# EAGLE design ONOFRE_ESTORES_COVERS_R1.1 (EAGLE 9.4.1)
CNAME: BH ONOFRE; CREVISION: 5.1; DESIGNER: BrunoHorta
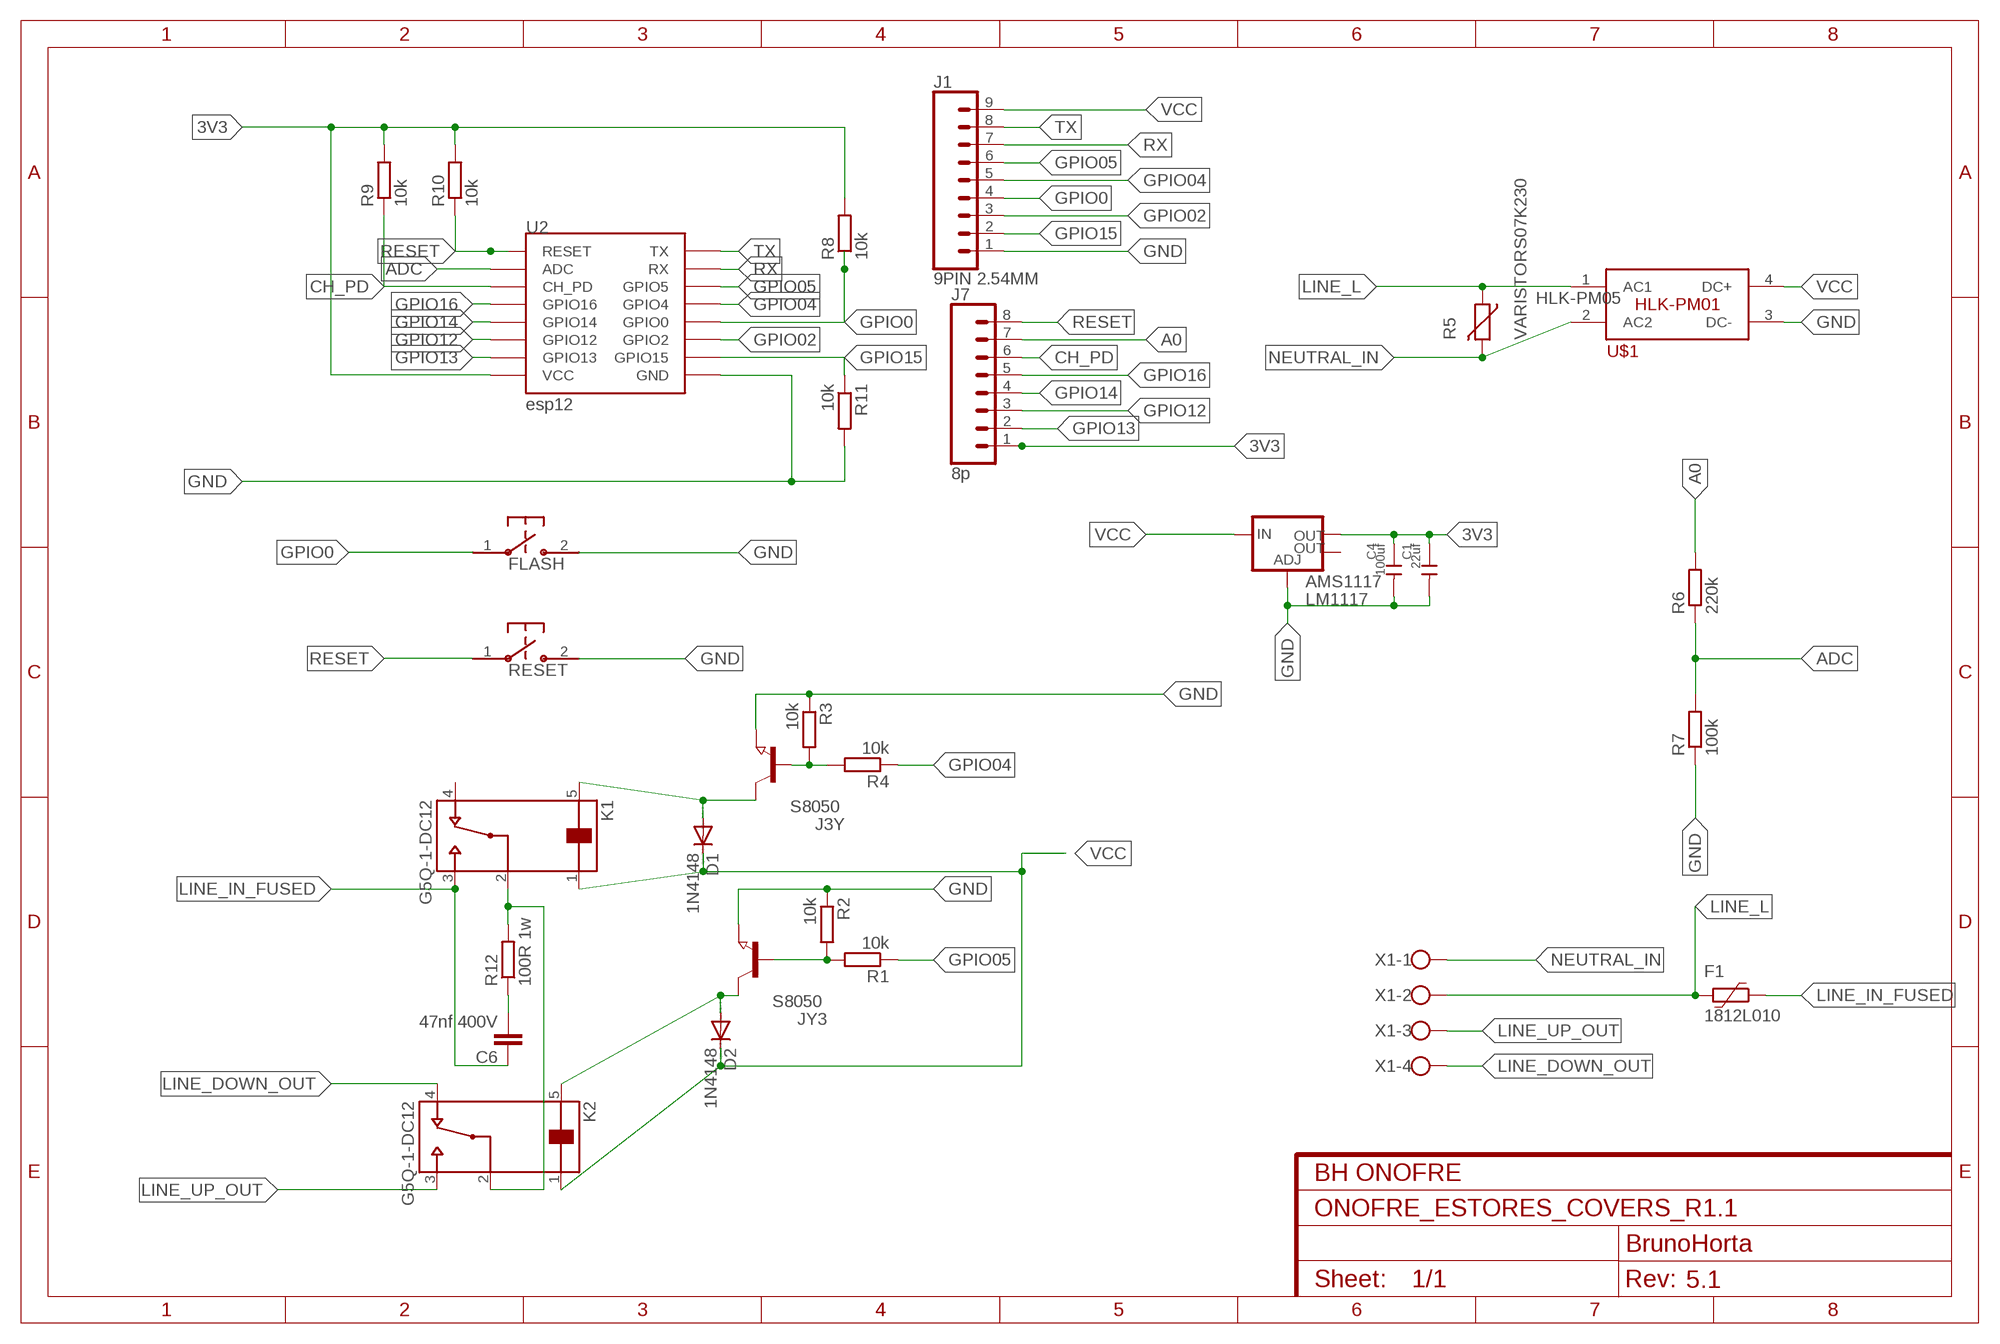
[diagram p0: schematic, sheet 1]

## Parts
AMS1117  LM1117  V_REG_LM1117SOT223  [SOT223]
C1  22uf  CERAMIC-1NF-1KV-10%-X7R(1206)  [C1206]
C4  100uf  CERAMIC-1NF-1KV-10%-X7R(1206)  [C1206]
C6  47nf 400V  C-EU102-043X133  [C102-043X133]
D1  1N4148  DIODE-SOD80C  [SOD80C]
D2  1N4148  DIODE-SOD80C  [SOD80C]
F1  1812L010  [1812L]
FLASH  B3U-1000P-2P-SMD  B3U-1000P  [B3U-1000P]
J1  9PIN 2.54MM  CONN_09  [1X09]
J3Y  S8050  NPN-TRANSISTOR_SOT23  [SOT23]
J7  8p  CONN_08"  [1X08]
JY3  S8050  NPN-TRANSISTOR_SOT23  [SOT23]
K1  G5Q-1-DC12  [RELAY_G5Q-1-DC12]
K2  G5Q-1-DC12  [RELAY_G5Q-1-DC12]
R1  10k  R-EU_R0603  [R0603]
R2  10k  R-EU_R0603  [R0603]
R3  10k  R-EU_R0603  [R0603]
R4  10k  R-EU_R0603  [R0603]
R5  VARISTORS07K230  [S07K230]
R6  220k  R-EU_R0603  [R0603]
R7  100k  R-EU_R0603  [R0603]
R8  10k  R-EU_R0603  [R0603]
R9  10k  R-EU_R0603  [R0603]
R10  10k  R-EU_R0603  [R0603]
R11  10k  R-EU_R0603  [R0603]
R12  100R 1w  R-EU_R2512  [R2512]
RESET  B3U-1000P-2P-SMD  B3U-1000P  [B3U-1000P]
U2  esp12  ESP12SMD  [ESP12-SMD]
U$1  HLK-PM01  [HLK-PM01]
X1  W237-4  [W237-4]

## Nets
3V3: AMS1117.2(OUT) C1.1 C4.1 J7.1 R8.2 R9.2 R10.2 U2.VCC
A0: J7.7 R6.2
ADC: R6.1 R7.2 U2.ADC
CH_PD: J7.6 R9.1 U2.CH_PD
GND: AMS1117.1(ADJ) C1.2 C4.2 FLASH.2 J1.1 J3Y.2(E) JY3.2(E) R2.1 R3.1 R7.1 R11.2 RESET.2 U2.GND U$1.3(DC-)
GPIO0: FLASH.1 J1.4 R8.1 U2.GPIO0
GPIO02: J1.3 U2.GPIO2
GPIO04: J1.5 R4.1 U2.GPIO4
GPIO05: J1.6 R1.1 U2.GPIO5
GPIO12: J7.3 U2.GPIO12
GPIO13: J7.2 U2.GPIO13
GPIO14: J7.4 U2.GPIO14
GPIO15: J1.2 R11.1 U2.GPIO15
GPIO16: J7.5 U2.GPIO16
LINE_DOWN_OUT [220V]: K2.4 X1.4
LINE_IN_FUSED [220V]: C6.1 F1.1 K1.3
LINE_L [220V]: F1.2 R5.1 U$1.1(AC1) X1.2
LINE_UP_OUT [220V]: K2.3 X1.3
N$1: D1.A J3Y.3(C) K1.5
N$3: K1.2 K2.2 R12.2
N$5: C6.2 R12.1
N$7: J3Y.1(B) R3.2 R4.2
N$9: D2.A JY3.3(C) K2.5
N$13: JY3.1(B) R1.2 R2.2
NEUTRAL_IN [220V]: R5.2 U$1.2(AC2) X1.1
RESET: J7.8 R10.1 RESET.1 U2.RESET
RX: J1.7 U2.RXD0(RX)
TX: J1.8 U2.TXD0(TX)
VCC: AMS1117.3(IN) D1.C D2.C J1.9 K1.1 K2.1 U$1.4(DC+)
Unconnected: AMS1117.4(OUT) K1.4

## Notes on the sheet
- HLK-PM05

## Library data of the parts
AMS1117 = SparkFun-IC-Power:V_REG_LM1117: Voltage Regulator LM1117 Standard adjustable voltage regulator but in SMD form. Spark Fun Electronics SKU : COM-00595; PROD_ID: VREG-08170
C1 C4 = Seeed-Capacitor:CERAMIC-1NF-1KV-10%-X7R?(1206): 302010189; MPN: CC1206KKX7RCBB102; VALUE: 1NF
C6 = rcl:C-EU: CAPACITOR, European symbol; SPICEPREFIX: C
D1 D2 = diode:DIODE-: DIODE
F1 = polyfuse-smd_10:?: Polyfuse Resettable PTC Source: http://www.littelfuse.com/products/resettable-ptcs.aspx; MF: Littelfuse; MPN: 1812L010; OC_FARNELL: 1822210; OC_NEWARK: 78R5551
FLASH RESET = switches:B3U: Switch; DIGIKEY: SW1020CT-ND; MANUFACTURER: Omron; MPN: B3U-1000P
J1 = SparkFun-Connectors:CONN_09: Multi connection point. Often used as Generic Header-pin footprint for 0.1 inch spaced/style header connections On any of the 0.1 inch spaced packages, you can populate with these: Break Away Headers - Straight <https://www.sparkfun.com/products/116> (PRT-00116) Break Away Male Headers - Right Angle <https://www.sparkfun.com/products/553> (PRT-00553) Female Headers <https://www.sparkfun.com/products/115> (PRT-00115) Break Away Headers - Machine Pin <https://www.sparkfun.com/products/117> (PRT-00117) Break Away Female Headers - Swiss Machine Pin <https://www.sparkfun.com/products/743> (PRT-00743) For SCREWTERMINALS and SPRING TERMINALS visit here: Screw Terimnals on SparkFun.com <https://www.sparkfun.com/search/results?term=Screw+Terminals> (5mm/3.5mm/2.54mm spacing) This device is also useful as a general connection point to wire up your design to another part of your project. Our various solder wires solder well into these plated through hole pads. Hook-Up Wire - Assortment (Stranded, 22 AWG) <https://www.sparkfun.com/products/11375> (PRT-11375) Hook-Up Wire - Assortment (Solid Core, 22 AWG) <https://www.sparkfun.com/products/11367> (PRT-11367) View the entire wire category on our website here <https://www.sparkfun.com/categories/141> Special notes: Molex polarized connector foot print use with SKU : PRT-08231 with associated crimp pins and housings. 1MM SMD Version SKU: PRT-10208 NOTES ON THE VARIANTS LOCK and LOCK_LONGPADS... This footprint was designed to help hold the alignment of a through-hole component (i.e. 6-pin header) while soldering it into place. You may notice that each hole has been shifted either up or down by 0.005 of an inch from it's more standard position (which is a perfectly straight line). This slight alteration caused the pins (the squares in the middle) to touch the edges of the holes. Because they are alternating, it causes a "brace" to hold the component in place. 0.005 has proven to be the perfect amount of "off-center" position when using our standard breakaway headers. Although looks a little odd when you look at the bare footprint, once you have a header in there, the alteration is very hard to notice. Also,if you push a header all the way into place, it is covered up entirely on the bottom side.
J3Y JY3 = semicon-smd-ipc:NPN-TRANSISTOR_: NPN TRANSISTOR
J7 = SparkFun-Connectors:CONN_08: Multi connection point. Often used as Generic Header-pin footprint for 0.1 inch spaced/style header connections On any of the 0.1 inch spaced packages, you can populate with these: Break Away Headers - Straight <https://www.sparkfun.com/products/116> (PRT-00116) Break Away Male Headers - Right Angle <https://www.sparkfun.com/products/553> (PRT-00553) Female Headers <https://www.sparkfun.com/products/115> (PRT-00115) Break Away Headers - Machine Pin <https://www.sparkfun.com/products/117> (PRT-00117) Break Away Female Headers - Swiss Machine Pin <https://www.sparkfun.com/products/743> (PRT-00743) Arduino Stackable Header - 8 Pin <https://www.sparkfun.com/products/9279> (PRT-09279) For SCREWTERMINALS and SPRING TERMINALS visit here: Screw Terimnals on SparkFun.com <https://www.sparkfun.com/search/results?term=Screw+Terminals> (5mm/3.5mm/2.54mm spacing) This device is also useful as a general connection point to wire up your design to another part of your project. Our various solder wires solder well into these plated through hole pads. Hook-Up Wire - Assortment (Stranded, 22 AWG) <https://www.sparkfun.com/products/11375> (PRT-11375) Hook-Up Wire - Assortment (Solid Core, 22 AWG) <https://www.sparkfun.com/products/11367> (PRT-11367) View the entire wire category on our website here <https://www.sparkfun.com/categories/141> Special notes: Molex polarized connector foot print use with SKU : PRT-08231 with associated crimp pins and housings. 1MM SMD Version SKU: PRT-10208 NOTES ON THE VARIANTS LOCK and LOCK_LONGPADS... This footprint was designed to help hold the alignment of a through-hole component (i.e. 6-pin header) while soldering it into place. You may notice that each hole has been shifted either up or down by 0.005 of an inch from it's more standard position (which is a perfectly straight line). This slight alteration caused the pins (the squares in the middle) to touch the edges of the holes. Because they are alternating, it causes a "brace" to hold the component in place. 0.005 has proven to be the perfect amount of "off-center" position when using our standard breakaway headers. Although looks a little odd when you look at the bare footprint, once you have a header in there, the alteration is very hard to notice. Also,if you push a header all the way into place, it is covered up entirely on the bottom side.; PROD_ID: CONN-08438
K1 K2 = G5Q-1-DC12:G5Q-1-DC12: Power Relay 12VDC 5(NO)A/3(NC)DCA/10(NO)A/3(NC)ACA SPDT (( 20.3mm 10.3mm 16.2mm)) Through Hole; AVAILABILITY: Unavailable; DESCRIPTION: Power Relay 12VDC 5_NO_A/3_NC_DCA/10_NO_A/3_NC_ACA SPDT __ 20.3mm 10.3mm 16.2mm__ Through Hole; MF: Omron; MP: G5Q-1-DC12; PACKAGE: None; PRICE: None
R1-R4 R6-R12 = resistor:R-EU_: RESISTOR, European symbol
R5 = varistor:VARISTOR: VARISTOR
U2 = esp8266modules:ESP12: ESP8266 Wifi module 12
U$1 = HLK-PM01:HLK-PM01; AVAILABILITY: Unavailable; MF: Hi-link; MP: hlk-pm01; PACKAGE: Package Analog Devices; PRICE: None
X1 = con-wago-500:W237-4: WAGO SCREW CLAMP; OC_FARNELL: unknown; OC_NEWARK: unknown

## Net classes
1 220V: width 1.27 mm, clearance 2 mm

## Board
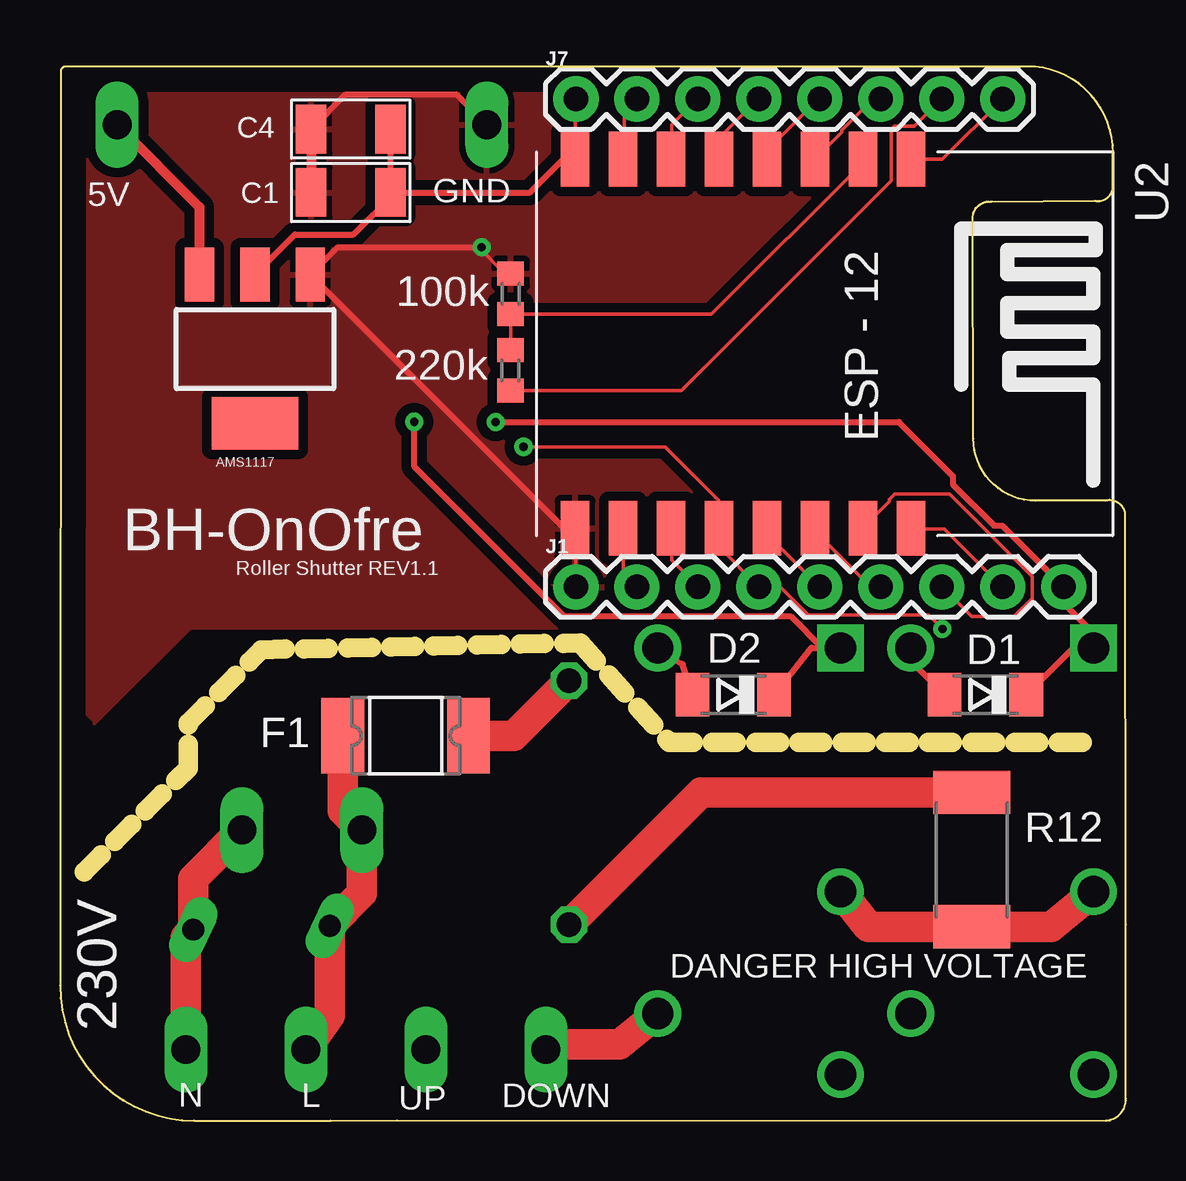
[diagram p1: board, top side]
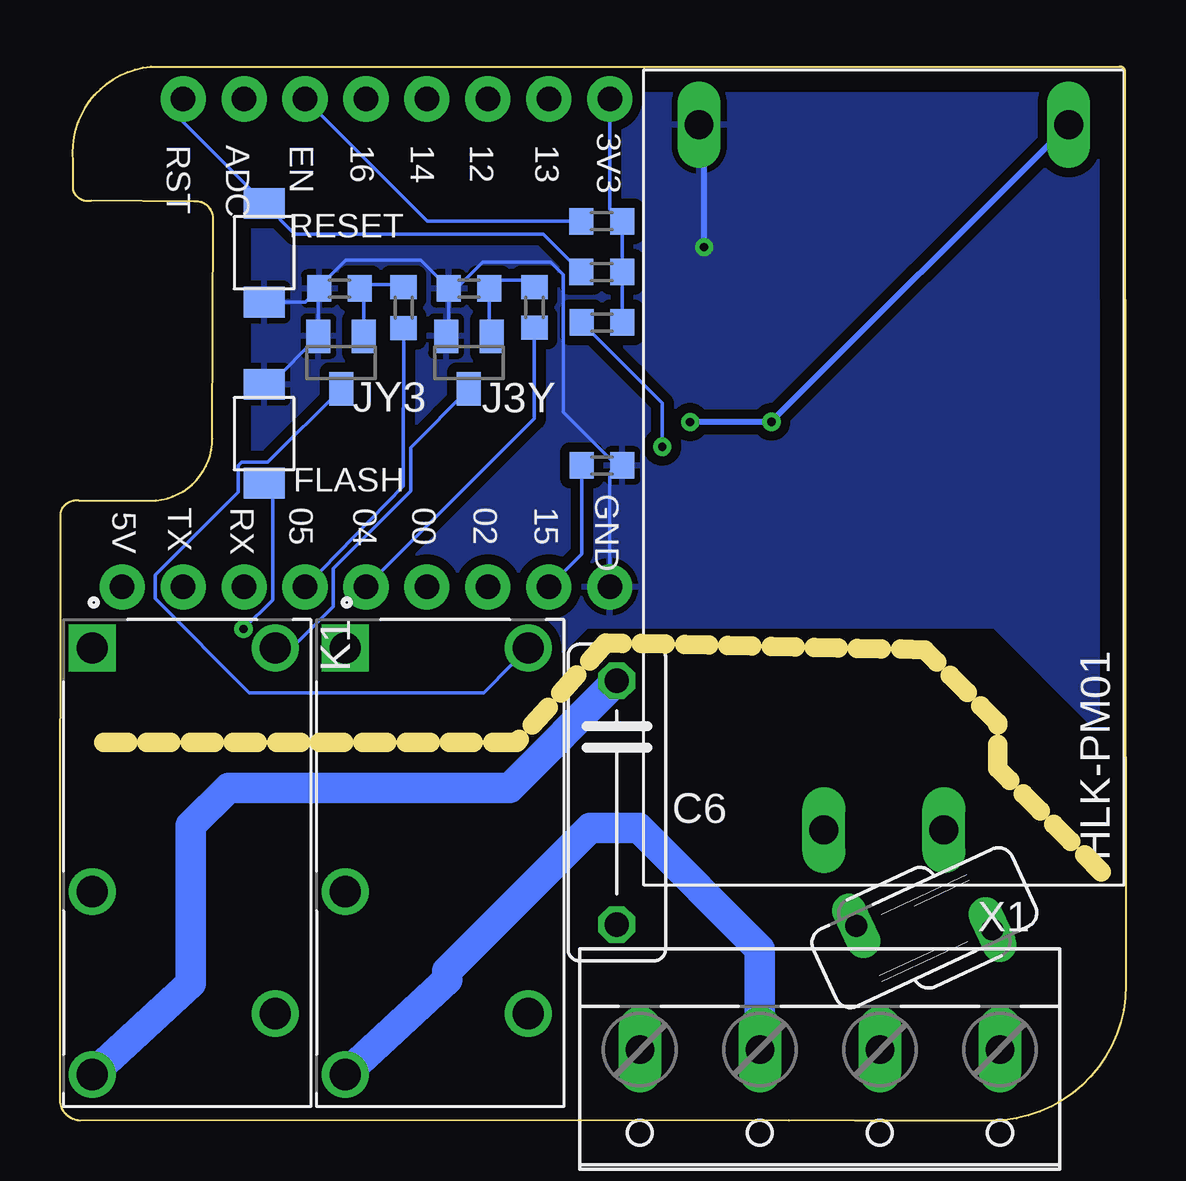
[diagram p2: board, bottom side, seen from below]

Size 44.41 x 43.94 mm. Coordinates in mm from the lower left corner, seen from the top.
Outline: 0.04,43.76 0,5.64 arc90 5.59,0 11.28,0 14.04,0.01 43.58,0 arc90 44.41,0.91 44.41,8.17 44.38,25.35 arc90 43.57,25.84 40.65,25.84 arc-90 38.06,28.43 38.03,37.69 arc-90 38.83,38.31 43.11,38.34 arc90 43.86,38.83 43.86,39.99 arc90 40.62,43.94 0.26,43.94 arc90 0.04,43.76
Copper layers (1*16): Top 0.035mm / dielectric 1.5mm / Bottom 0.035mm
Design rules "default": minimum track width 6mil, minimum drill 0.35mm, track to track 6mil, track to pad 6mil, pad to pad 6mil, via to via 6mil, smd to smd 6mil, copper to edge 40mil, drill to drill 6mil, minimum pad ring 10mil, minimum via ring 8mil, stop-mask expansion 4mil, vias tented up to drill 0mil, thermal gap 10mil
Milling: 31 lines

### Footprints (pad centres in the part's own frame; a part is rotated, then mirrored left to right if it is on the bottom)
SOT223 = smd 1.219 x 2.235: 1 -2.311,-3.099; 2 0,-3.099; 3 2.311,-3.099 | smd 3.6 x 2.2: 4 0,3.099
C1206 = smd 1.27 x 2.032: 1 -1.651,0; 2 1.651,0
C102-043X133 = drill 1.016 octagon: 1 -5.08,0; 2 5.08,0
SOD80C = smd 1.4 x 1.8: A 1.7,0; C -1.7,0
1812L = smd 1.78 x 3.15: 1 -2.62,0; 2 2.62,0
B3U-1000P = smd 1.283 x 1.7: 1 -2.056,0; 2 2.056,0
1X09 = drill 1.016 pad 1.88: 1 0,0; 2 2.54,0; 3 5.08,0; 4 7.62,0; 5 10.16,0; 6 12.7,0; 7 15.24,0; 8 17.78,0; 9 20.32,0
SOT23 = smd 1 x 1.4: 1 -0.95,-1.1; 2 0.95,-1.1; 3 0,1.1
1X08 = drill 1.016 pad 1.88: 1 0,0; 2 2.54,0; 3 5.08,0; 4 7.62,0; 5 10.16,0; 6 12.7,0; 7 15.24,0; 8 17.78,0
RELAY_G5Q-1-DC12 = drill 1.3 square: 1 -8.97,-3.96 | drill 1.3: 2 1.19,-3.96; 3 8.81,-3.96; 4 6.27,3.66; 5 -8.97,3.66
R0603 = smd 1 x 1.1: 1 -0.85,0; 2 0.85,0
S07K230 = drill 0.914 long: 1 -1.27,-2.54; 2 1.27,2.54
R2512 = smd 1.8 x 3.2: 1 -2.8,0; 2 2.8,0
ESP12-SMD = smd 2.286 x 1.2: ADC -7.792,3.8; CH_PD -7.792,1.8; GND 7.592,-8.2; GPIO0 7.592,-2.2; GPIO2 7.592,-4.2; GPIO4 7.592,-0.2; GPIO5 7.592,1.8; GPIO12 -7.792,-4.2; GPIO13 -7.792,-6.2; GPIO14 -7.792,-2.2; GPIO15 7.592,-6.2; GPIO16 -7.792,-0.2; RESET -7.792,5.8; RXD0 7.592,3.8; TXD0 7.592,5.8; VCC -7.792,-8.2
HLK-PM01 = drill 1.2 long: 1 -14.7,2.5; 2 -14.7,-2.5; 3 14.7,7.7; 4 14.7,-7.7
W237-4 = drill 1.194 long: 1 -7.5,-1.27; 2 -2.5,-1.27; 3 2.5,-1.27; 4 7.5,-1.27

### Placement (x,y rotation side)
AMS1117  8.12,32.17 180 top
C1  12.12,38.69 180 top
C4  12.12,41.33 180 top
C6  21.21,13.26 270 bottom
D1  38.56,17.76 180 top
D2  28.05,17.76 180 top
F1  14.41,16.05 180 top
FLASH  35.9,28.64 90 bottom
J1  21.5,22.25 0 top
J3Y  27.37,31.6 180 bottom
J7  21.5,42.59 0 top
JY3  32.69,31.6 180 bottom
K1  39.1,10.74 270 bottom
K2  28.56,10.74 270 bottom
R1  30.09,33.89 90 bottom
R2  32.76,34.69 0 bottom
R3  27.36,34.69 0 bottom
R4  24.64,33.9 90 bottom
R5  8.39,8.04 295 bottom
R6  18.77,31.28 270 top
R7  18.77,34.47 270 top
R8  21.82,33.27 0 bottom
R9  21.83,37.49 0 bottom
R10  21.83,35.38 0 bottom
R11  21.82,27.31 0 bottom
R12  37.99,10.89 270 top
RESET  35.9,36.18 270 bottom
U2  29.66,32.28 270 top
U$1  10.08,26.81 90 bottom
X1  12.74,1.7 180 bottom

### Tracks (layer width: path | path; a pad name or v marks a point on that pad's centre or on a via)
3V3
  Top 0.152: U2.VCC 21.46,40.57 21.46,42.55 J7.1 | 13.75,39.28 13.75,38.83 C1.1 13.76,38.86 13.75,39.28
  Top 0.254: C4.1 13.77,38.86 13.76,38.86 | C1.1 13.98,38.69 | 13.98,38.69 19.58,38.69 21.46,40.57 | AMS1117.2 9.79,36.93 12.22,36.93 13.98,38.69
  Bottom 0.152: R8.2 R10.2 20.98,37.48 | 20.98,37.48 R9.2 | R9.2 | J7.1 21.5,38 20.98,37.48
A0
  Top 0.152: J7.7 35.6,41.45 34.77,41.45 34.63,41.31 34.63,39.18 25.88,30.43 R6.2
ADC
  Top 0.152: U2.ADC 33.46,39.94 27.13,33.62 R7.2 R6.1
CH_PD
  Top 0.152: U2.CH_PD 31.51,40.14 32.58,41.2 32.58,41.28 33.87,42.57 34.18,42.57 J7.6
  Bottom 0.152: R9.1 29.1,37.49 J7.6
GND  (via drill 0.35)
  Top 0.152: U2.GND arc-90 21.5,24.65 21.5,23.85 J1.1 | R7.1 18.54,35.32 17.44,36.41
  Top 0.254: C4.2 11.91,42.78 16.41,42.78 16.51,42.78 U$1.3 | v17.57,36.41 17.44,36.41 11.58,36.41 AMS1117.1 21.5,24.2 21.5,23.85
  Top 0.406: C4.2 C1.2
  Bottom 0.152: R2.1 33.64,34.72 JY3.2 35.65,30.69 FLASH.2 | J1.1 21.5,26.88 arc90 R11.2 21.22,27.33 23.43,29.54 23.43,35.26 23.97,35.79 26.78,35.79 27.85,34.73 28.16,34.73 R3.1 | R3.1 28.21,32.8 J3Y.2 | R3.1 28.23,34.73 29.38,35.87 32.5,35.87 33.57,34.8 R2.1 | RESET.2 34.18,34.12 R2.1
  Bottom 0.254: v17.57,36.41 17.57,41.3 U$1.3
  pour Top (isolate 0.406): 0.22,43.62 0.22,17.85 1.44,16.63 1.44,16.53 5.44,20.53 22.41,20.53 24.99,17.95 24.99,16.68 43.59,16.68 43.71,16.8 43.71,23.32 42.02,25.01 36.79,25.01 36.79,38.63 38.48,40.32 41.1,40.32 41.09,40.32 41.09,43.66 0.26,43.66
  pour Bottom (isolate 0.406): 0.22,43.62 0.22,17.78 1.45,16.54 5.48,20.57 22.43,20.57 25.37,17.63 25.37,16.64 43.67,16.64 43.67,23.36 41.98,25.05 37.03,25.05 36.37,25.71 36.37,38.38 38.35,40.36 41.2,40.36 41.2,43.83 0.42,43.83
GPIO0  (via drill 0.35)
  Top 0.152: v36.76,20.5 36.68,20.59 36.68,20.6 36.19,21.08 31.17,21.08 30.01,22.25 J1.4 27.46,23.91 27.46,24.3 | 27.46,24.3 U2.GPIO0 | v19.31,28.09 25.21,28.09 27.44,25.86 27.44,24.33 27.46,24.3
  Bottom 0.152: FLASH.1 35.55,26.57 35.55,21.71 v36.76,20.5 | R8.1 19.31,29.91 v19.31,28.09
GPIO02
  Top 0.152: U2.GPIO2 25.49,24.67 25.49,23.37 26.56,22.31 J1.3
GPIO04
  Top 0.152: U2.GPIO4 29.53,24.67 29.53,24.36 31.59,22.31 J1.5
  Bottom 0.152: R4.1 24.64,29.27 J1.5
GPIO05
  Top 0.152: U2.GPIO5 31.51,24.67 31.51,24.52 33.72,22.31 34.18,22.31 J1.6
  Bottom 0.152: R1.1 30.11,26.46 J1.6
GPIO12
  Top 0.152: U2.GPIO12 25.49,40.14 25.49,41.51 26.56,42.57 J7.3
GPIO13
  Top 0.152: U2.GPIO13 23.51,40.14 23.51,42.12 23.97,42.57 J7.2
GPIO14
  Top 0.152: U2.GPIO14 27.47,40.14 27.47,40.97 29.07,42.57 J7.4
GPIO15
  Top 0.152: U2.GPIO15 23.46,22.83 J1.2
  Bottom 0.152: R11.1 22.67,23.62 J1.2
GPIO16
  Top 0.152: U2.GPIO16 29.53,40.14 29.53,40.52 31.59,42.57 J7.5
LINE_DOWN_OUT
  Top 1.27: X1.4 20.45,3.19 23.33,3.19 K2.4
LINE_IN_FUSED
  Top 1.27: F1.1 18.91,16.05 C6.1
  Bottom 1.27: C6.1 25.67,13.88 37.38,13.88 38.95,12.3 38.95,5.73 K1.3
LINE_L
  Top 1.27: F1.2 11.78,12.91 U$1.1 12.58,9.47 R5.1 11.23,4.39 X1.2
LINE_UP_OUT
  Bottom 1.27: K2.3 28.27,5.88 28.27,6.24 22.31,12.2 20.3,12.2 15.25,7.15 15.25,3.41 X1.3
N$1
  Top 0.254: D1.A 35.44,19.17 K1.5
  Bottom 0.152: J3Y.3 29.8,28.07 29.8,26.24 33.02,23.02 33.02,21.44 34.75,19.71 K1.5
N$3
  Top 1.27: K1.2 41.29,8.09 R12.2 33.68,8.09 K2.2
N$5
  Top 1.27: R12.1 26.72,13.69 C6.2
N$7
  Bottom 0.152: J3Y.1 26.51,32.8 R3.2 26.48,34.73 26.17,35.03 24.65,35.03 R4.2
N$9
  Top 0.254: D2.A 25.95,19 25.91,19.04 25.23,19.38 K2.5
  Bottom 0.152: JY3.3 35.74,27.45 36.84,27.45 36.98,27.32 36.98,26.2 40.45,22.74 40.45,21.77 36.52,17.84 26.75,17.84 25.58,19.01 24.9,19.44 K2.5
N$13
  Bottom 0.152: JY3.1 31.74,34.58 R2.2 31.74,34.65 31.69,34.86 30.48,34.86 R1.2
NEUTRAL_IN
  Top 1.27: X1.1 5.24,7.65 R5.2 5.55,10.09 U$1.2
RESET
  Top 0.152: U2.RESET 36.77,40.08 J7.8
  Bottom 0.152: R10.1 24.26,36.96 34.62,36.96 RESET.1 39.28,41.62 J7.8
RX
  Top 0.152: U2.RXD0 33.49,24.74 34.56,25.81 34.56,25.89 34.79,26.12 37.07,26.12 40.5,22.69 40.5,21.77 39.74,21.01 37.99,21.01 36.77,22.23 J1.7
TX
  Top 0.152: U2.TXD0 35.47,24.67 36.84,24.67 39.21,22.31 J1.8
VCC  (via drill 0.35)
  Top 0.254: v18.15,29.12 34.95,29.12 37.2,26.87 37.2,26.52 38.92,24.81 39.26,24.81 J1.9 41.82,21.56 43.06,20.32 K1.1 42.21,19.71 D1.C | v14.76,29.13 14.76,27.26 21.02,21.01 30.46,21.01 31.76,19.71 K2.1 31.3,19.71 D2.C
  Top 0.406: U$1.4 5.81,38.09 AMS1117.3
  Bottom 0.254: U$1.4 v14.76,29.13 14.77,29.12 v18.15,29.12

### Text on the board
tNames: 5V | GND | BH-OnOfre | Roller Shutter REV1.1 | DANGER HIGH VOLTAGE | 230V | UP | N | L | DOWN
bNames: 3V3 | 13 | 12 | 14 | 16 | EN | ADC | RST | GND | 15 | 02 | 00 | 04 | 05 | RX | TX | 5V